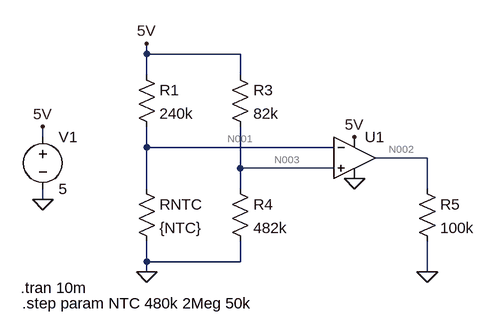
[diagram p0: schematic NTC_Dev.asc]
NTC_Dev.asc, the LTspice schematic file:
Version 4
SHEET 1 880 680
WIRE 192 0 192 -16
WIRE 336 0 192 0
WIRE 192 32 192 0
WIRE 336 32 336 0
WIRE 32 128 32 112
WIRE 192 144 192 112
WIRE 480 144 192 144
WIRE 624 160 544 160
WIRE 336 176 336 112
WIRE 480 176 336 176
WIRE 192 208 192 144
WIRE 336 208 336 176
WIRE 624 208 624 160
WIRE 32 224 32 208
WIRE 192 320 192 288
WIRE 336 320 336 288
WIRE 336 320 192 320
WIRE 192 336 192 320
WIRE 624 336 624 288
FLAG 32 224 0
FLAG 32 112 5V
FLAG 192 336 0
FLAG 192 -16 5V
FLAG 512 128 5V
FLAG 512 192 0
FLAG 624 336 0
SYMBOL voltage 32 112 R0
SYMATTR InstName V1
SYMATTR Value 5
SYMBOL res 176 16 R0
SYMATTR InstName R1
SYMATTR Value 240k
SYMBOL res 176 192 R0
SYMATTR InstName RNTC
SYMATTR Value {NTC}
SYMBOL res 320 16 R0
SYMATTR InstName R3
SYMATTR Value 82k
SYMBOL res 320 192 R0
SYMATTR InstName R4
SYMATTR Value 482k
SYMBOL Opamps\\UniversalOpamp2 512 160 R0
SYMATTR InstName U1
SYMBOL res 608 192 R0
SYMATTR InstName R5
SYMATTR Value 100k
TEXT -2 360 Left 2 !.tran 10m
TEXT 0 384 Left 2 !.step param NTC 480k 2Meg 50k

The netlist it stands for:
* NTC_Dev.asc
V1 5V 0 5
R1 5V N001 240k
RNTC N001 0 {NTC}
R3 5V N003 82k
R4 N003 0 482k
XU1 N003 N001 5V 0 N002 level.2 Avol=1Meg GBW=10Meg Slew=10Meg ilimit=25m rail=0 Vos=0 phimargin=45 en=0 enk=0 in=0 ink=0 Rin=500Meg  ; pins IN+ IN- V+ V- OUT
R5 N002 0 100k
.tran 10m
.step param NTC 480k 2Meg 50k
.lib UniversalOpamps2.sub
.backanno
.end

* Results of the author's LTspice run, read from the files saved beside the schematic
* Operating Point (first step), zero values left out:
*   ntc = 480 k
*   V(5v) = 5 V
*   V(n001) = 3.333 V
*   V(n003) = 4.273 V
*   V(n002) = 4.999 V
*   I(R5) = 49.99 µA
*   I(R4) = 8.865 µA
*   I(R3) = 8.868 µA
*   I(Rntc) = 6.944 µA
*   I(R1) = 6.946 µA
*   I(V1) = -66.33 µA
*   Ix(u1:1) = 3.546 nA
*   Ix(u1:2) = 1.666 nA
*   Ix(u1:3) = 50.52 µA
*   Ix(u1:4) = -603.5 nA
*   Ix(u1:5) = -49.99 µA
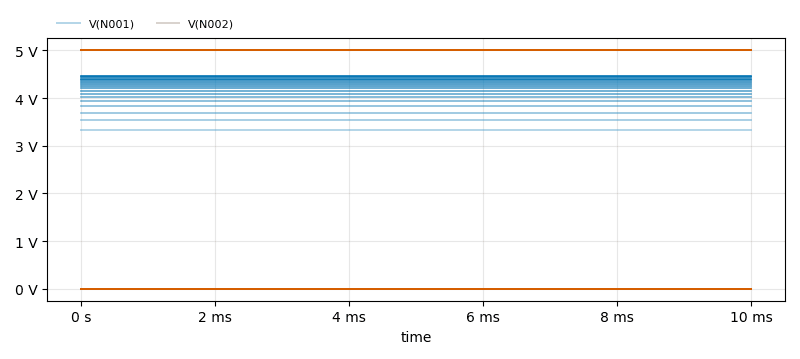
[diagram p1: Transient Analysis of NTC_Dev.asc, plotted from the saved traces]
* Transient Analysis, 32 runs:
*   V(N001) [run 1]: min 3.333 V, max 3.333 V, average 3.333 V, rms 3.333 V, last 3.333 V
*   V(N001) [run 2]: min 3.536 V, max 3.536 V, average 3.536 V, rms 3.536 V, last 3.536 V
*   V(N001) [run 3]: min 3.695 V, max 3.695 V, average 3.695 V, rms 3.695 V, last 3.695 V
*   V(N001) [run 4]: min 3.823 V, max 3.823 V, average 3.823 V, rms 3.823 V, last 3.823 V
*   V(N001) [run 5]: min 3.928 V, max 3.928 V, average 3.928 V, rms 3.928 V, last 3.928 V
*   V(N001) [run 6]: min 4.016 V, max 4.016 V, average 4.016 V, rms 4.016 V, last 4.016 V
*   V(N001) [run 7]: min 4.09 V, max 4.09 V, average 4.09 V, rms 4.09 V, last 4.09 V
*   V(N001) [run 8]: min 4.154 V, max 4.154 V, average 4.154 V, rms 4.154 V, last 4.154 V
*   V(N002) [run 1]: min 4.999 V, max 4.999 V, average 4.999 V, rms 4.999 V, last 4.999 V
*   V(N002) [run 2]: min 4.999 V, max 4.999 V, average 4.999 V, rms 4.999 V, last 4.999 V
*   V(N002) [run 3]: min 4.999 V, max 4.999 V, average 4.999 V, rms 4.999 V, last 4.999 V
*   V(N002) [run 4]: min 4.999 V, max 4.999 V, average 4.999 V, rms 4.999 V, last 4.999 V
*   V(N002) [run 5]: min 4.999 V, max 4.999 V, average 4.999 V, rms 4.999 V, last 4.999 V
*   V(N002) [run 6]: min 4.999 V, max 4.999 V, average 4.999 V, rms 4.999 V, last 4.999 V
*   V(N002) [run 7]: min 4.999 V, max 4.999 V, average 4.999 V, rms 4.999 V, last 4.999 V
*   V(N002) [run 8]: min 4.999 V, max 4.999 V, average 4.999 V, rms 4.999 V, last 4.999 V